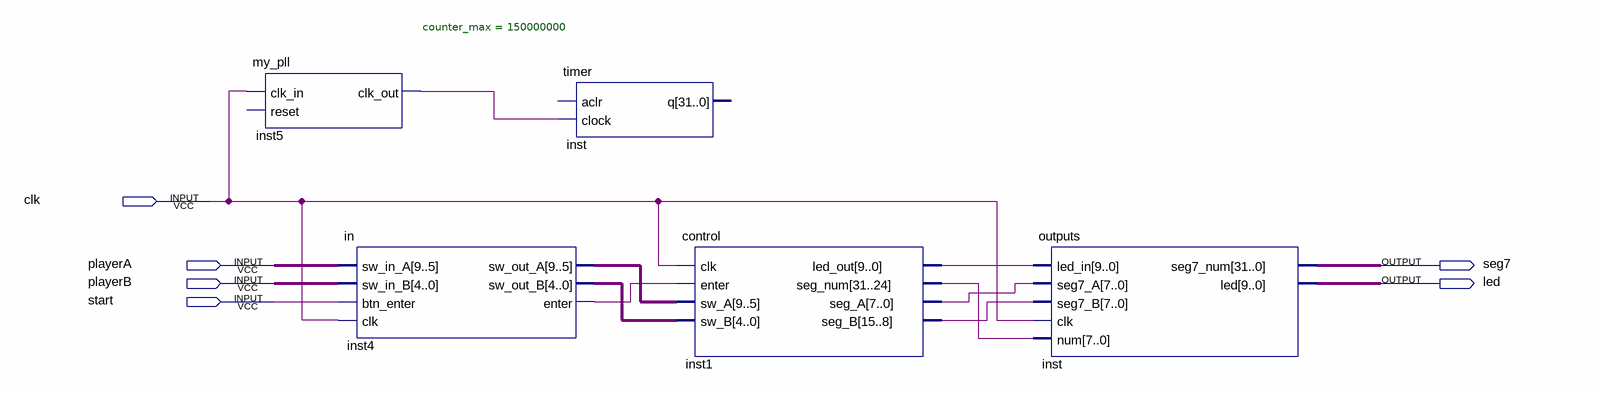
[diagram p0: schematic sheet]
// Quartus schematic Group09.bdf.bdf as structural Verilog: 5 symbols, 6 pins
module \Group09.bdf  (
  input  clk,
  input  playerA,
  input  playerB,
  input  start,
  output seg7,
  output led
);

  wire inst4_enter, inst5_clk_out;
  wire [4:0] inst4_sw_out_a, inst4_sw_out_b, undriven, undriven_2;
  wire [7:0] inst1_seg_a, inst1_seg_b, inst1_seg_num;
  wire [9:0] inst1_led_out, inst_led;
  wire [31:0] inst_seg7_num;

  my_pll #(.counter_max(150000000)) inst5 (.clk_in(clk), .clk_out(inst5_clk_out));  // open: reset
  in inst4 (
    .sw_in_A(undriven), .sw_in_B(undriven_2), .btn_enter(start), .clk(clk), .sw_out_A(inst4_sw_out_a),
    .sw_out_B(inst4_sw_out_b), .enter(inst4_enter));
  timer inst (.clock(inst5_clk_out));  // open: aclr, q
  control inst1 (
    .clk(clk), .enter(inst4_enter), .sw_A(inst4_sw_out_a), .sw_B(inst4_sw_out_b), .led_out(inst1_led_out),
    .seg_num(inst1_seg_num), .seg_A(inst1_seg_a), .seg_B(inst1_seg_b));
  outputs inst_dup2 (
    .led_in(inst1_led_out), .seg7_A(inst1_seg_a), .seg7_B(inst1_seg_b), .clk(clk), .num(inst1_seg_num),
    .seg7_num(inst_seg7_num), .led(inst_led));
endmodule
